# Altium schematic sheet BMS_rev1.SchDoc
size E
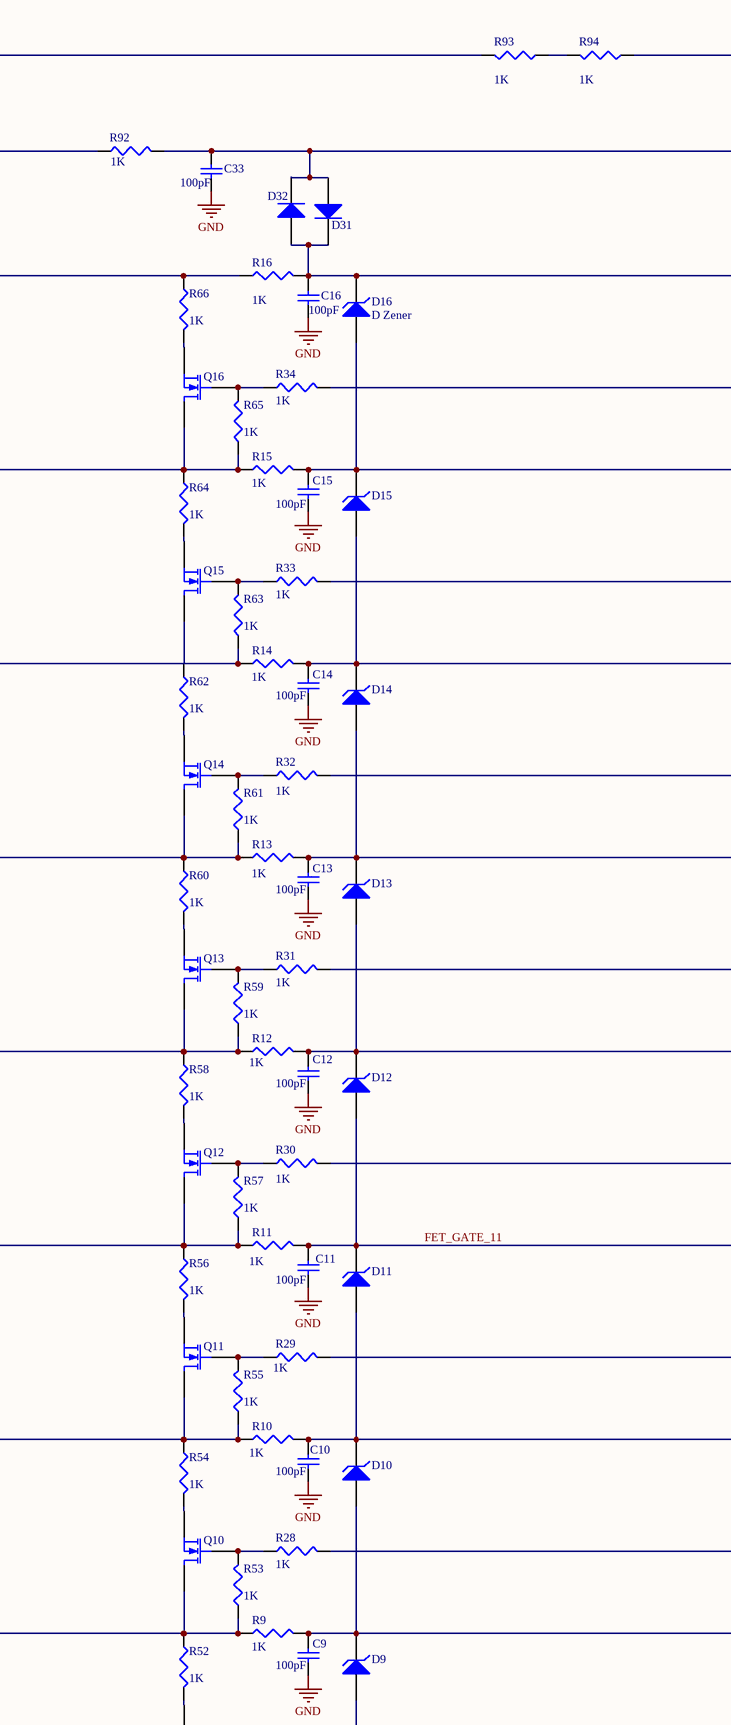
[diagram p0: BMS_rev1.SchDoc, top left]
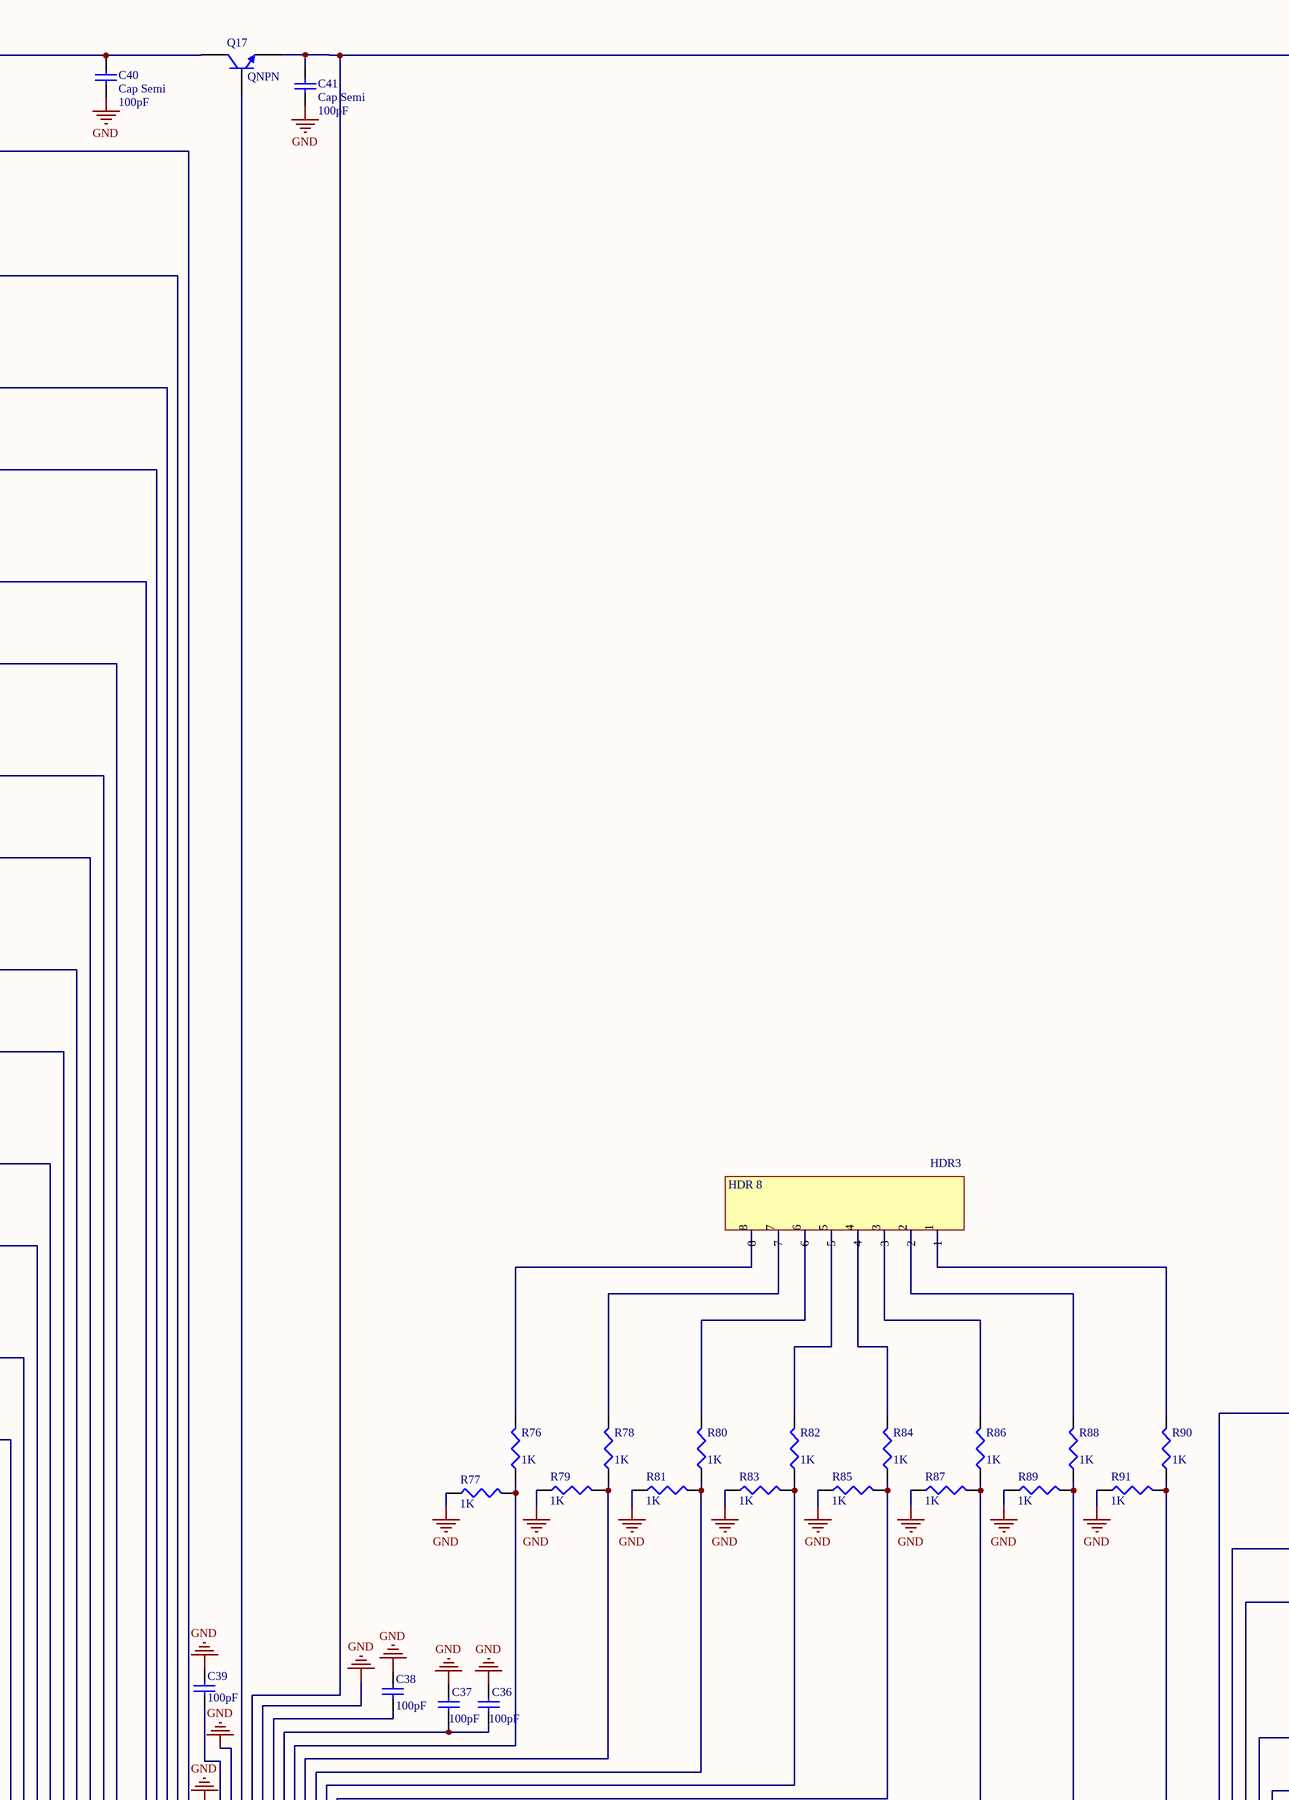
[diagram p1: BMS_rev1.SchDoc, top middle]
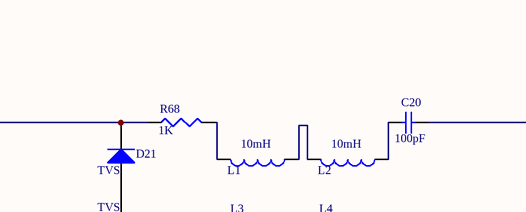
[diagram p2: BMS_rev1.SchDoc, top right]
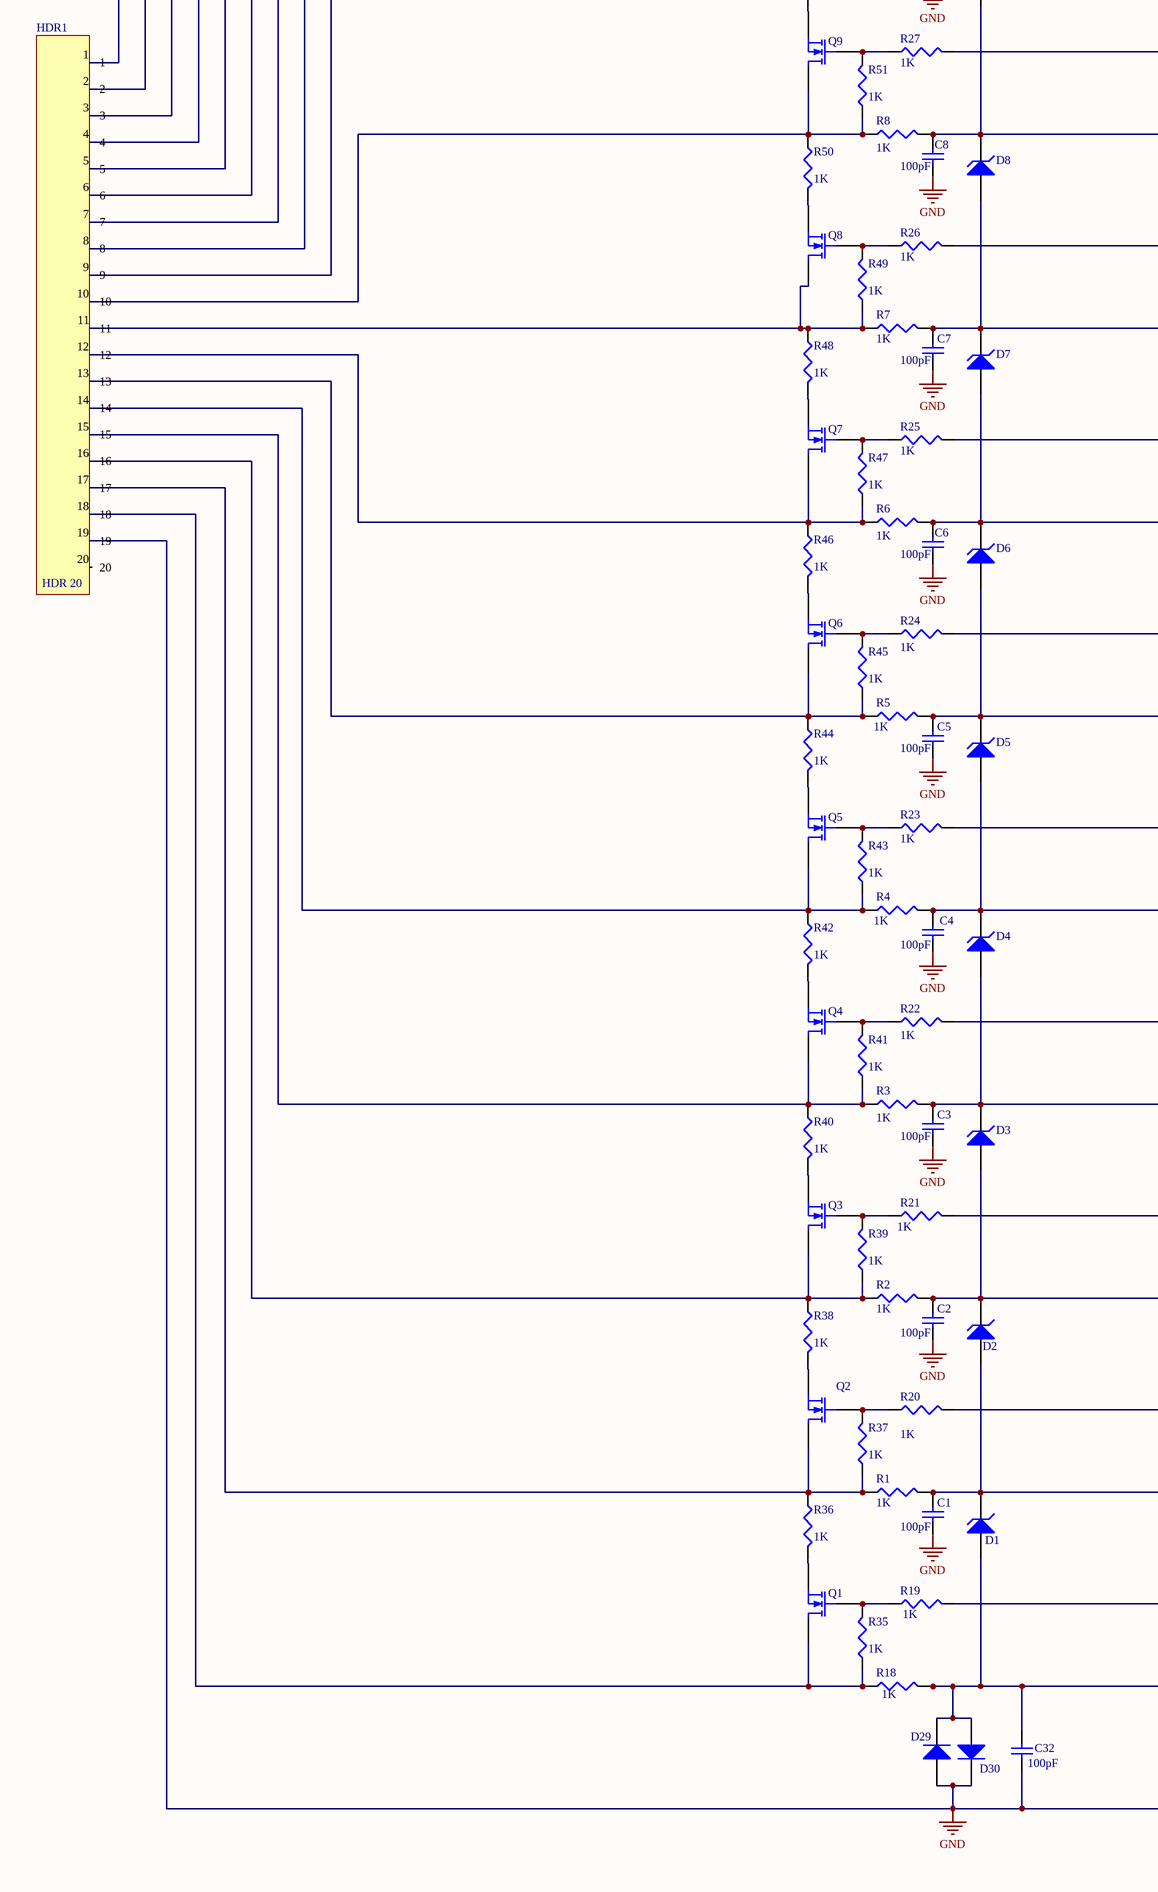
[diagram p3: BMS_rev1.SchDoc, bottom left]
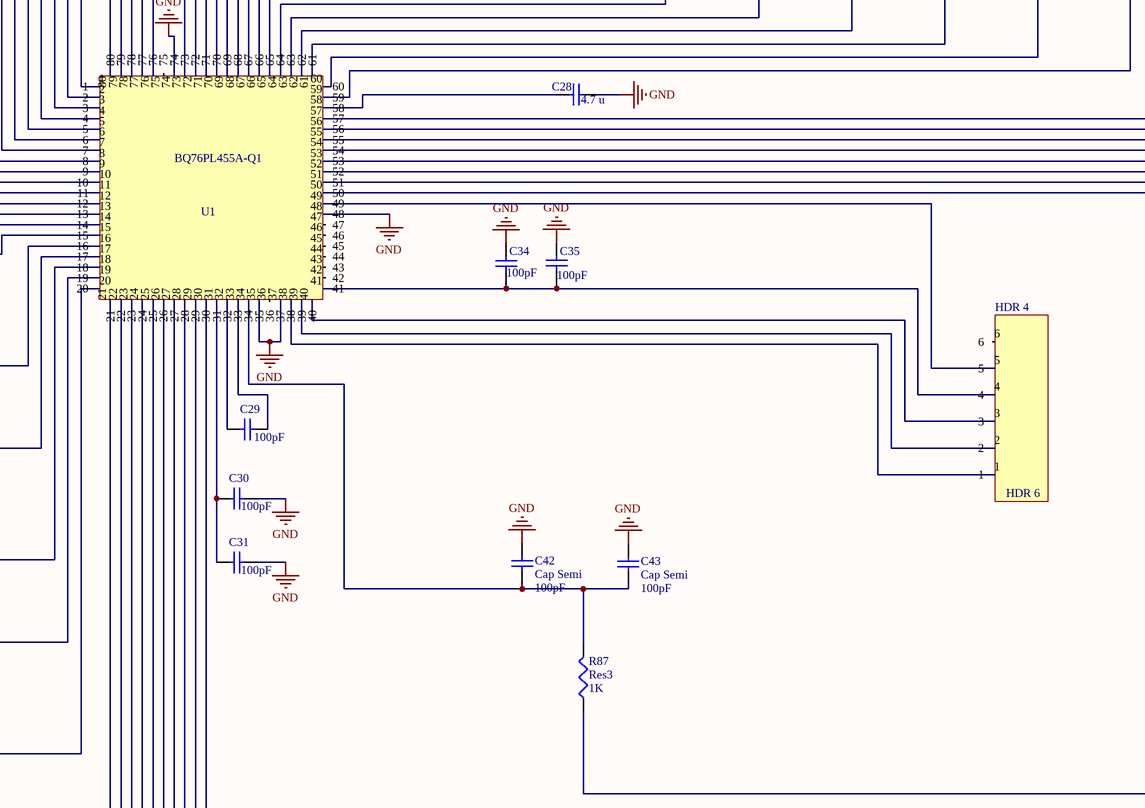
[diagram p4: BMS_rev1.SchDoc, bottom middle]
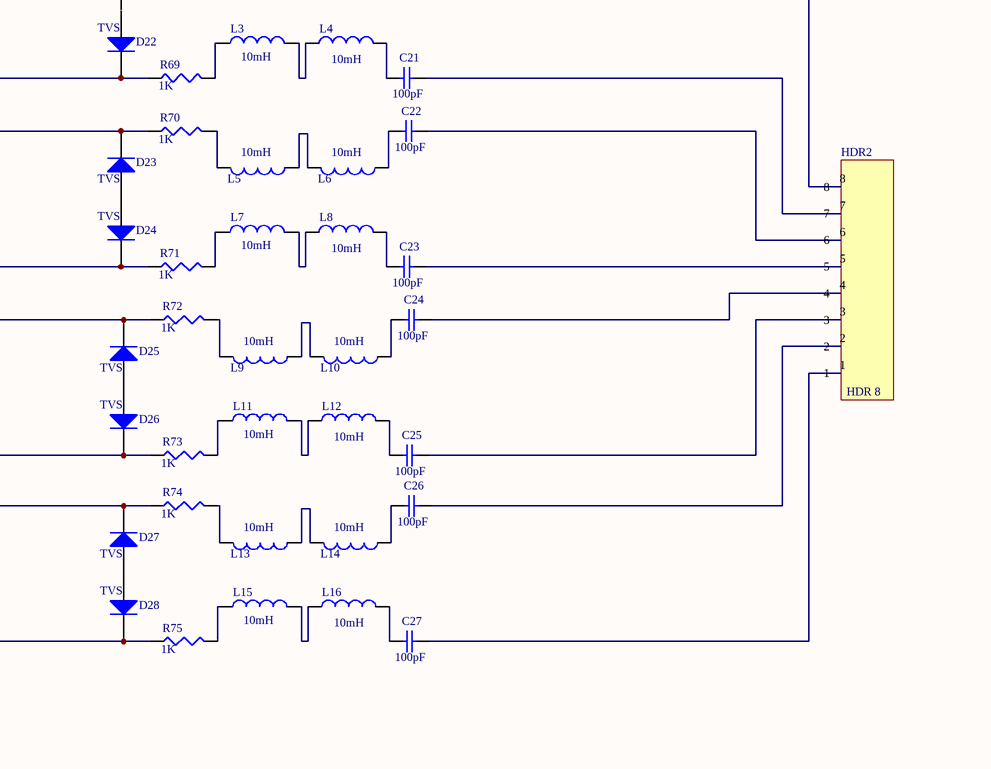
[diagram p5: BMS_rev1.SchDoc, bottom right]

## Parts
(Parts that share a designator on the sheet are numbered #1, #2 ... from top to bottom, then left to right.)
C1  value 100pF  [C1206]  (hidden comment: Cap Semi)
C2  value 100pF  [C1206]  (hidden comment: Cap Semi)
C3  value 100pF  [C1206]  (hidden comment: Cap Semi)
C4  value 100pF  [C1206]  (hidden comment: Cap Semi)
C5  value 100pF  [C1206]  (hidden comment: Cap Semi)
C6  value 100pF  [C1206]  (hidden comment: Cap Semi)
C7  value 100pF  [C1206]  (hidden comment: Cap Semi)
C8  value 100pF  [C1206]  (hidden comment: Cap Semi)
C9  value 100pF  [C1206]  (hidden comment: Cap Semi)
C10  value 100pF  [C1206]  (hidden comment: Cap Semi)
C11  value 100pF  [C1206]  (hidden comment: Cap Semi)
C12  value 100pF  [C1206]  (hidden comment: Cap Semi)
C13  value 100pF  [C1206]  (hidden comment: Cap Semi)
C14  value 100pF  [C1206]  (hidden comment: Cap Semi)
C15  value 100pF  [C1206]  (hidden comment: Cap Semi)
C16  value 100pF  [C1206]  (hidden comment: Cap Semi)
C20  value 100pF  [C1206]  (hidden comment: Cap Semi)
C21  value 100pF  [C1206]  (hidden comment: Cap Semi)
C22  value 100pF  [C1206]  (hidden comment: Cap Semi)
C23  value 100pF  [C1206]  (hidden comment: Cap Semi)
C24  value 100pF  [C1206]  (hidden comment: Cap Semi)
C25  value 100pF  [C1206]  (hidden comment: Cap Semi)
C26  value 100pF  [C1206]  (hidden comment: Cap Semi)
C27  value 100pF  [C1206]  (hidden comment: Cap Semi)
C28  value 4.7 u  [C1206]  (hidden comment: Cap Semi)
C29  value 100pF  [C1206]  (hidden comment: Cap Semi)
C30  value 100pF  [C1206]  (hidden comment: Cap Semi)
C31  value 100pF  [C1206]  (hidden comment: Cap Semi)
C32  value 100pF  [C1206]  (hidden comment: Cap Semi)
C33  value 100pF  [C1206]  (hidden comment: Cap Semi)
C34  value 100pF  [C1206]  (hidden comment: Cap Semi)
C35  value 100pF  [C1206]  (hidden comment: Cap Semi)
C36  value 100pF  [C1206]  (hidden comment: Cap Semi)
C37  value 100pF  [C1206]  (hidden comment: Cap Semi)
C38  value 100pF  [C1206]  (hidden comment: Cap Semi)
C39  value 100pF  [C1206]  (hidden comment: Cap Semi)
C40  Cap Semi  value 100pF  [C1206]
C41  Cap Semi  value 100pF  [C1206]
C42  Cap Semi  value 100pF  [C1206]
C43  Cap Semi  value 100pF  [C1206]
D1  D Zener  [DIODE-0.7]  (value not drawn)
D2  D Zener  [DIODE-0.7]  (value not drawn)
D3  D Zener  [DIODE-0.7]  (value not drawn)
D4  D Zener  [DIODE-0.7]  (value not drawn)
D5  D Zener  [DIODE-0.7]  (value not drawn)
D6  D Zener  [DIODE-0.7]  (value not drawn)
D7  D Zener  [DIODE-0.7]  (value not drawn)
D8  D Zener  [DIODE-0.7]  (value not drawn)
D9  D Zener  [DIODE-0.7]  (value not drawn)
D10  D Zener  [DIODE-0.7]  (value not drawn)
D11  D Zener  [DIODE-0.7]  (value not drawn)
D12  D Zener  [DIODE-0.7]  (value not drawn)
D13  D Zener  [DIODE-0.7]  (value not drawn)
D14  D Zener  [DIODE-0.7]  (value not drawn)
D15  D Zener  [DIODE-0.7]  (value not drawn)
D16  D Zener  [DIODE-0.7]
D21  TVS  [SMC]
D22  TVS  [SMC]
D23  TVS  [SMC]
D24  TVS  [SMC]
D25  TVS  [SMC]
D26  TVS  [SMC]
D27  TVS  [SMC]
D28  TVS  [SMC]
D29  (no value)  [SMC]
D30  (no value)  [SMC]
D31  Diode  [SMC]  (value not drawn)
D32  Diode  [SMC]  (value not drawn)
HDR1  HDR 20
HDR2  HDR 8
HDR3  HDR 8
HDR_4  HDR 6
L1  value 10mH  [0402-A]  (hidden comment: Inductor)
L2  value 10mH  [0402-A]  (hidden comment: Inductor)
L3  value 10mH  [0402-A]  (hidden comment: Inductor)
L4  value 10mH  [0402-A]  (hidden comment: Inductor)
L5  value 10mH  [0402-A]  (hidden comment: Inductor)
L6  value 10mH  [0402-A]  (hidden comment: Inductor)
L7  value 10mH  [0402-A]  (hidden comment: Inductor)
L8  value 10mH  [0402-A]  (hidden comment: Inductor)
L9  value 10mH  [0402-A]  (hidden comment: Inductor)
L10  value 10mH  [0402-A]  (hidden comment: Inductor)
L11  value 10mH  [0402-A]  (hidden comment: Inductor)
L12  value 10mH  [0402-A]  (hidden comment: Inductor)
L13  value 10mH  [0402-A]  (hidden comment: Inductor)
L14  value 10mH  [0402-A]  (hidden comment: Inductor)
L15  value 10mH  [0402-A]  (hidden comment: Inductor)
L16  value 10mH  [0402-A]  (hidden comment: Inductor)
Q1  MOSFET-N  [E3]  (value not drawn)
Q2  MOSFET-N  [E3]  (value not drawn)
Q3  MOSFET-N  [E3]  (value not drawn)
Q4  MOSFET-N  [E3]  (value not drawn)
Q5  MOSFET-N  [E3]  (value not drawn)
Q6  MOSFET-N  [E3]  (value not drawn)
Q7  MOSFET-N  [E3]  (value not drawn)
Q8  MOSFET-N  [E3]  (value not drawn)
Q9  MOSFET-N  [E3]  (value not drawn)
Q10  MOSFET-N  [E3]  (value not drawn)
Q11  MOSFET-N  [E3]  (value not drawn)
Q12  MOSFET-N  [E3]  (value not drawn)
Q13  MOSFET-N  [E3]  (value not drawn)
Q14  MOSFET-N  [E3]  (value not drawn)
Q15  MOSFET-N  [E3]  (value not drawn)
Q16  MOSFET-N  [E3]  (value not drawn)
Q17  QNPN  [SOT-23B_N]
R1  value 1K  [J1-0603]  (hidden comment: Res3)
R2  value 1K  [J1-0603]  (hidden comment: Res3)
R3  value 1K  [J1-0603]  (hidden comment: Res3)
R4  value 1K  [J1-0603]  (hidden comment: Res3)
R5  value 1K  [J1-0603]  (hidden comment: Res3)
R6  value 1K  [J1-0603]  (hidden comment: Res3)
R7  value 1K  [J1-0603]  (hidden comment: Res3)
R8  value 1K  [J1-0603]  (hidden comment: Res3)
R9  value 1K  [J1-0603]  (hidden comment: Res3)
R10  value 1K  [J1-0603]  (hidden comment: Res3)
R11  value 1K  [J1-0603]  (hidden comment: Res3)
R12  value 1K  [J1-0603]  (hidden comment: Res3)
R13  value 1K  [J1-0603]  (hidden comment: Res3)
R14  value 1K  [J1-0603]  (hidden comment: Res3)
R15  value 1K  [J1-0603]  (hidden comment: Res3)
R16  value 1K  [J1-0603]  (hidden comment: Res3)
R18  value 1K  [J1-0603]  (hidden comment: Res3)
R19  value 1K  [J1-0603]  (hidden comment: Res3)
R20  value 1K  [J1-0603]  (hidden comment: Res3)
R21  value 1K  [J1-0603]  (hidden comment: Res3)
R22  value 1K  [J1-0603]  (hidden comment: Res3)
R23  value 1K  [J1-0603]  (hidden comment: Res3)
R24  value 1K  [J1-0603]  (hidden comment: Res3)
R25  value 1K  [J1-0603]  (hidden comment: Res3)
R26  value 1K  [J1-0603]  (hidden comment: Res3)
R27  value 1K  [J1-0603]  (hidden comment: Res3)
R28  value 1K  [J1-0603]  (hidden comment: Res3)
R29  value 1K  [J1-0603]  (hidden comment: Res3)
R30  value 1K  [J1-0603]  (hidden comment: Res3)
R31  value 1K  [J1-0603]  (hidden comment: Res3)
R32  value 1K  [J1-0603]  (hidden comment: Res3)
R33  value 1K  [J1-0603]  (hidden comment: Res3)
R34  value 1K  [J1-0603]  (hidden comment: Res3)
R35  value 1K  [J1-0603]  (hidden comment: Res3)
R36  value 1K  [J1-0603]  (hidden comment: Res3)
R37  value 1K  [J1-0603]  (hidden comment: Res3)
R38  value 1K  [J1-0603]  (hidden comment: Res3)
R39  value 1K  [J1-0603]  (hidden comment: Res3)
R40  value 1K  [J1-0603]  (hidden comment: Res3)
R41  value 1K  [J1-0603]  (hidden comment: Res3)
R42  value 1K  [J1-0603]  (hidden comment: Res3)
R43  value 1K  [J1-0603]  (hidden comment: Res3)
R44  value 1K  [J1-0603]  (hidden comment: Res3)
R45  value 1K  [J1-0603]  (hidden comment: Res3)
R46  value 1K  [J1-0603]  (hidden comment: Res3)
R47  value 1K  [J1-0603]  (hidden comment: Res3)
R48  value 1K  [J1-0603]  (hidden comment: Res3)
R49  value 1K  [J1-0603]  (hidden comment: Res3)
R50  value 1K  [J1-0603]  (hidden comment: Res3)
R51  value 1K  [J1-0603]  (hidden comment: Res3)
R52  value 1K  [J1-0603]  (hidden comment: Res3)
R53  value 1K  [J1-0603]  (hidden comment: Res3)
R54  value 1K  [J1-0603]  (hidden comment: Res3)
R55  value 1K  [J1-0603]  (hidden comment: Res3)
R56  value 1K  [J1-0603]  (hidden comment: Res3)
R57  value 1K  [J1-0603]  (hidden comment: Res3)
R58  value 1K  [J1-0603]  (hidden comment: Res3)
R59  value 1K  [J1-0603]  (hidden comment: Res3)
R60  value 1K  [J1-0603]  (hidden comment: Res3)
R61  value 1K  [J1-0603]  (hidden comment: Res3)
R62  value 1K  [J1-0603]  (hidden comment: Res3)
R63  value 1K  [J1-0603]  (hidden comment: Res3)
R64  value 1K  [J1-0603]  (hidden comment: Res3)
R65  value 1K  [J1-0603]  (hidden comment: Res3)
R66  value 1K  [J1-0603]  (hidden comment: Res3)
R68  value 1K  [J1-0603]  (hidden comment: Res3)
R69  value 1K  [J1-0603]  (hidden comment: Res3)
R70  value 1K  [J1-0603]  (hidden comment: Res3)
R71  value 1K  [J1-0603]  (hidden comment: Res3)
R72  value 1K  [J1-0603]  (hidden comment: Res3)
R73  value 1K  [J1-0603]  (hidden comment: Res3)
R74  value 1K  [J1-0603]  (hidden comment: Res3)
R75  value 1K  [J1-0603]  (hidden comment: Res3)
R76  value 1K  [J1-0603]  (hidden comment: Res3)
R77  value 1K  [J1-0603]  (hidden comment: Res3)
R78  value 1K  [J1-0603]  (hidden comment: Res3)
R79  value 1K  [J1-0603]  (hidden comment: Res3)
R80  value 1K  [J1-0603]  (hidden comment: Res3)
R81  value 1K  [J1-0603]  (hidden comment: Res3)
R82  value 1K  [J1-0603]  (hidden comment: Res3)
R83  value 1K  [J1-0603]  (hidden comment: Res3)
R84  value 1K  [J1-0603]  (hidden comment: Res3)
R85  value 1K  [J1-0603]  (hidden comment: Res3)
R86  value 1K  [J1-0603]  (hidden comment: Res3)
R87#1  value 1K  [J1-0603]  (hidden comment: Res3)
R87#2  Res3  value 1K  [J1-0603]
R88  value 1K  [J1-0603]  (hidden comment: Res3)
R89  value 1K  [J1-0603]  (hidden comment: Res3)
R90  value 1K  [J1-0603]  (hidden comment: Res3)
R91  value 1K  [J1-0603]  (hidden comment: Res3)
R92  value 1K  [J1-0603]  (hidden comment: Res3)
R93  value 1K  [J1-0603]  (hidden comment: Res3)
R94  value 1K  [J1-0603]  (hidden comment: Res3)
U1  BQ76PL455A-Q1

## Nets
GND: C1.1 C2.1 C3.1 C4.1 C5.1 C6.1 C7.1 C8.1 C9.1 C10.1 C11.1 C12.1 C13.1 C14.1 C15.1 C16.1 C28.2 C30.2 C31.2 C32.1 C33.1 C34.1 C35.1 C36.1 C37.1 C38.1 C39.1 C40.1 C41.1 C42.2 C43.2 D29.1(A) D30.2(K) HDR1.19 R77.1 R79.1 R81.1 R83.1 R85.1 R87#1.1 R89.1 R91.1 U1.30 U1.35 U1.37 U1.48 U1.69 U1.72 U1.74
FET_GATE_11: C11.2 D11.2(K) D12.1(A) R11.2 U1.7
NetC1_2: C1.2 D1.2(K) D2.1(A) R1.2 U1.27
NetC2_2: C2.2 D2.2(K) D3.1(A) R2.2 U1.25
NetC3_2: C3.2 D3.2(K) D4.1(A) R3.2 U1.23
NetC4_2: C4.2 D4.2(K) D5.1(A) R4.2 U1.21
NetC5_2: C5.2 D5.2(K) D6.1(A) R5.2 U1.19
NetC6_2: C6.2 D6.2(K) D7.1(A) R6.2 U1.17
NetC7_2: C7.2 D7.2(K) D8.1(A) R7.2 U1.15
NetC8_2: C8.2 D8.2(K) D9.1(A) R8.2 U1.13
NetC9_2: C9.2 D9.2(K) D10.1(A) R9.2 U1.11
NetC10_2: C10.2 D10.2(K) D11.1(A) R10.2 U1.9
NetC12_2: C12.2 D12.2(K) D13.1(A) R12.2 U1.5
NetC13_2: C13.2 D13.2(K) D14.1(A) R13.2 U1.3
NetC14_2: C14.2 D14.2(K) D15.1(A) R14.2 U1.1
NetC15_2: C15.2 D15.2(K) D16.1(A) R15.2 U1.79
NetC16_2: C16.2 D16.2(K) D31.2(K) D32.1(A) R16.2 U1.77
NetC20_1: C20.1 L2.1
NetC20_2: C20.2 HDR2.8
NetC21_1: C21.1 L4.2
NetC21_2: C21.2 HDR2.7
NetC22_1: C22.1 L6.1
NetC22_2: C22.2 HDR2.6
NetC23_1: C23.1 L8.2
NetC23_2: C23.2 HDR2.5
NetC24_1: C24.1 L10.1
NetC24_2: C24.2 HDR2.4
NetC25_1: C25.1 L12.2
NetC25_2: C25.2 HDR2.3
NetC26_1: C26.1 L14.1
NetC26_2: C26.2 HDR2.2
NetC27_1: C27.1 L16.2
NetC27_2: C27.2 HDR2.1
NetC28_1: C28.1 U1.58
NetC29_1: C29.1 U1.32
NetC29_2: C29.2 U1.33
NetC30_1: C30.1 C31.1 U1.31
NetC32_2: C32.2 D1.1(A) D29.2(K) D30.1(A) R18.2 U1.29
NetC33_2: C33.2 D31.1(A) D32.2(K) R92.2 U1.76
NetC34_2: C34.2 C35.2 HDR_4.4 U1.41
NetC36_2: C36.2 C37.2 U1.67
NetC38_2: C38.2 U1.68
NetC39_2: C39.2 U1.73
NetC40_2: C40.2 Q17.1(C) R94.1
NetC41_2: C41.2 Q17.3(E) R87#2.1 U1.70
NetC42_1: C42.1 C43.1 R87#2.2 U1.34
NetD21_1: D21.1(A) D22.1(A)
NetD21_2: D21.2(K) R68.1 U1.57
NetD22_2: D22.2(K) R69.1 U1.56
NetD23_1: D23.1(A) D24.1(A)
NetD23_2: D23.2(K) R70.1 U1.55
NetD24_2: D24.2(K) R71.1 U1.54
NetD25_1: D25.1(A) D26.1(A)
NetD25_2: D25.2(K) R72.1 U1.53
NetD26_2: D26.2(K) R73.1 U1.52
NetD27_1: D27.1(A) D28.1(A)
NetD27_2: D27.2(K) R74.1 U1.51
NetD28_2: D28.2(K) R75.1 U1.50
NetHDR1_1: HDR1.1 R92.1 R93.2
NetHDR1_2: HDR1.2 R16.1 R66.1
NetHDR1_3: HDR1.3 Q16.1(D) R15.1 R64.1 R65.1
NetHDR1_4: HDR1.4 Q15.1(D) R14.1 R62.1 R63.1
NetHDR1_5: HDR1.5 Q14.1(D) R13.1 R60.1 R61.1
NetHDR1_6: HDR1.6 Q13.1(D) R12.1 R58.1 R59.1
NetHDR1_7: HDR1.7 Q12.1(D) R11.1 R56.1 R57.1
NetHDR1_8: HDR1.8 Q11.1(D) R10.1 R54.1 R55.1
NetHDR1_9: HDR1.9 Q10.1(D) R9.1 R52.1 R53.1
NetHDR1_10: HDR1.10 Q9.1(D) R8.1 R50.1 R51.1
NetHDR1_11: HDR1.11 Q8.1(D) R7.1 R48.1 R49.1
NetHDR1_12: HDR1.12 Q7.1(D) R6.1 R46.1 R47.1
NetHDR1_13: HDR1.13 Q6.1(D) R5.1 R44.1 R45.1
NetHDR1_14: HDR1.14 Q5.1(D) R4.1 R42.1 R43.1
NetHDR1_15: HDR1.15 Q4.1(D) R3.1 R40.1 R41.1
NetHDR1_16: HDR1.16 Q3.1(D) R2.1 R38.1 R39.1
NetHDR1_17: HDR1.17 Q2.1(D) R1.1 R36.1 R37.1
NetHDR1_18: HDR1.18 Q1.1(D) R18.1 R35.1
NetHDR3_1: HDR3.1 R90.2
NetHDR3_2: HDR3.2 R88.2
NetHDR3_3: HDR3.3 R86.2
NetHDR3_4: HDR3.4 R84.2
NetHDR3_5: HDR3.5 R82.2
NetHDR3_6: HDR3.6 R80.2
NetHDR3_7: HDR3.7 R78.2
NetHDR3_8: HDR3.8 R76.2
NetHDR_4_1: HDR_4.1 U1.38
NetHDR_4_2: HDR_4.2 U1.39
NetHDR_4_3: HDR_4.3 U1.40
NetHDR_4_5: HDR_4.5 U1.49
NetL1_1: L1.1 L2.2
NetL1_2: L1.2 R68.2
NetL3_1: L3.1 R69.2
NetL3_2: L3.2 L4.1
NetL5_1: L5.1 L6.2
NetL5_2: L5.2 R70.2
NetL7_1: L7.1 R71.2
NetL7_2: L7.2 L8.1
NetL9_1: L9.1 L10.2
NetL9_2: L9.2 R72.2
NetL11_1: L11.1 R73.2
NetL11_2: L11.2 L12.1
NetL13_1: L13.1 L14.2
NetL13_2: L13.2 R74.2
NetL15_1: L15.1 R75.2
NetL15_2: L15.2 L16.1
NetQ1_2: Q1.2(G) R19.1 R35.2
NetQ1_3: Q1.3(S) R36.2
NetQ2_2: Q2.2(G) R20.1 R37.2
NetQ2_3: Q2.3(S) R38.2
NetQ3_2: Q3.2(G) R21.1 R39.2
NetQ3_3: Q3.3(S) R40.2
NetQ4_2: Q4.2(G) R22.1 R41.2
NetQ4_3: Q4.3(S) R42.2
NetQ5_2: Q5.2(G) R23.1 R43.2
NetQ5_3: Q5.3(S) R44.2
NetQ6_2: Q6.2(G) R24.1 R45.2
NetQ6_3: Q6.3(S) R46.2
NetQ7_2: Q7.2(G) R25.1 R47.2
NetQ7_3: Q7.3(S) R48.2
NetQ8_2: Q8.2(G) R26.1 R49.2
NetQ8_3: Q8.3(S) R50.2
NetQ9_2: Q9.2(G) R27.1 R51.2
NetQ9_3: Q9.3(S) R52.2
NetQ10_2: Q10.2(G) R28.1 R53.2
NetQ10_3: Q10.3(S) R54.2
NetQ11_2: Q11.2(G) R29.1 R55.2
NetQ11_3: Q11.3(S) R56.2
NetQ12_2: Q12.2(G) R30.1 R57.2
NetQ12_3: Q12.3(S) R58.2
NetQ13_2: Q13.2(G) R31.1 R59.2
NetQ13_3: Q13.3(S) R60.2
NetQ14_2: Q14.2(G) R32.1 R61.2
NetQ14_3: Q14.3(S) R62.2
NetQ15_2: Q15.2(G) R33.1 R63.2
NetQ15_3: Q15.3(S) R64.2
NetQ16_2: Q16.2(G) R34.1 R65.2
NetQ16_3: Q16.3(S) R66.2
NetQ17_2: Q17.2(B) U1.71
NetR19_2: R19.2 U1.28
NetR20_2: R20.2 U1.26
NetR21_2: R21.2 U1.24
NetR22_2: R22.2 U1.22
NetR23_2: R23.2 U1.20
NetR24_2: R24.2 U1.18
NetR25_2: R25.2 U1.16
NetR26_2: R26.2 U1.14
NetR27_2: R27.2 U1.12
NetR28_2: R28.2 U1.10
NetR29_2: R29.2 U1.8
NetR30_2: R30.2 U1.6
NetR31_2: R31.2 U1.4
NetR32_2: R32.2 U1.2
NetR33_2: R33.2 U1.80
NetR34_2: R34.2 U1.78
NetR76_1: R76.1 R77.2 U1.66
NetR78_1: R78.1 R79.2 U1.65
NetR80_1: R80.1 R81.2 U1.64
NetR82_1: R82.1 R83.2 U1.63
NetR84_1: R84.1 R85.2 U1.62
NetR86_1: R86.1 R87#1.2 U1.61
NetR88_1: R88.1 R89.2 U1.60
NetR90_1: R90.1 R91.2 U1.59
NetR93_1: R93.1 R94.2

Not connected (* = marked no-connect by the designer): HDR1 20; HDR_4 6; U1 36 42 43 44 45 46 47 75

## Library data of the parts
C1-C16 C20-C43 = Cap Semi: Capacitor (Semiconductor SIM Model); Published: 8-Jun-2000; LatestRevisionDate: 29-May-2009; LatestRevisionNote: IPC-7351 Footprint Added.; PackageReference: C1206; Publisher: Altium Limited; PackageDescription: Chip Capacitor
D1-D16 = D Zener: Zener Diode; Published: 8-Jun-2000; LatestRevisionDate: 17-Jul-2002; LatestRevisionNote: Re-released for DXP Platform.; PackageReference: DIODE-0.7; Publisher: Altium Limited; PackageDescription: Diode, Thru-Hole; 2 Leads; 0.7 in Pin Spacing
D21-D32 = Diode: Default Diode; Published: 8-Jun-2000; LatestRevisionDate: 17-Jul-2002; LatestRevisionNote: Re-released for DXP Platform.; PackageVersion: Sep-1996; PackageReference: SMC; Publisher: Altium Limited; PackageDescription: DO-214-AB/SMC; 2 C-Bend Leads; Body 7.9 x 5.9 mm, inc. leads (LxW); Code_JEDEC: DO-214-AB
L1-L16 = Inductor: Code_IEC: 1005; Published: 8-Jun-2000; LatestRevisionDate: 29-May-2009; LatestRevisionNote: IPC-7351 Footprint Added.; PackageReference: 0402-A; Publisher: Altium Limited; PackageDescription: Chip Inductor; Code_JEITA: 0402
Q1-Q16 = MOSFET-N: N-Channel MOSFET; Published: 8-Jun-2000; LatestRevisionDate: 17-Jul-2002; LatestRevisionNote: Re-released for DXP Platform.; PackageVersion: 1995/1996; PackageReference: E3; Publisher: Altium Limited; PackageDescription: TO, Flat Index; 3 In-Line, Axial Leads; Body Dia. 4.6mm; Lead Dia. 0.5 mm (max)
Q17 = QNPN: NPN Bipolar Transistor; Published: 8-Jun-2000; LatestRevisionDate: 29-May-2009; LatestRevisionNote: IPC-7351 Footprint Added.; PackageVersion: Aug-1999; PackageReference: SOT-23B; Publisher: Altium Limited; PackageDescription: 3-Pin SOT-23 Package 0.95 mm Pitch, 2.4 mm Lead Span
R1-R16 R18-R66 R68-R86 R87#1 R87#2 R88-R94 = Res3: Resistor; Published: 8-Jun-2000; LatestRevisionDate: 29-May-2009; LatestRevisionNote: IPC-7351 Footprint Added.; PackageReference: J1-0603; Publisher: Altium Limited; PackageDescription: Chip Resistor